# Altium schematic sheet LPC1343.SchDoc
size A4
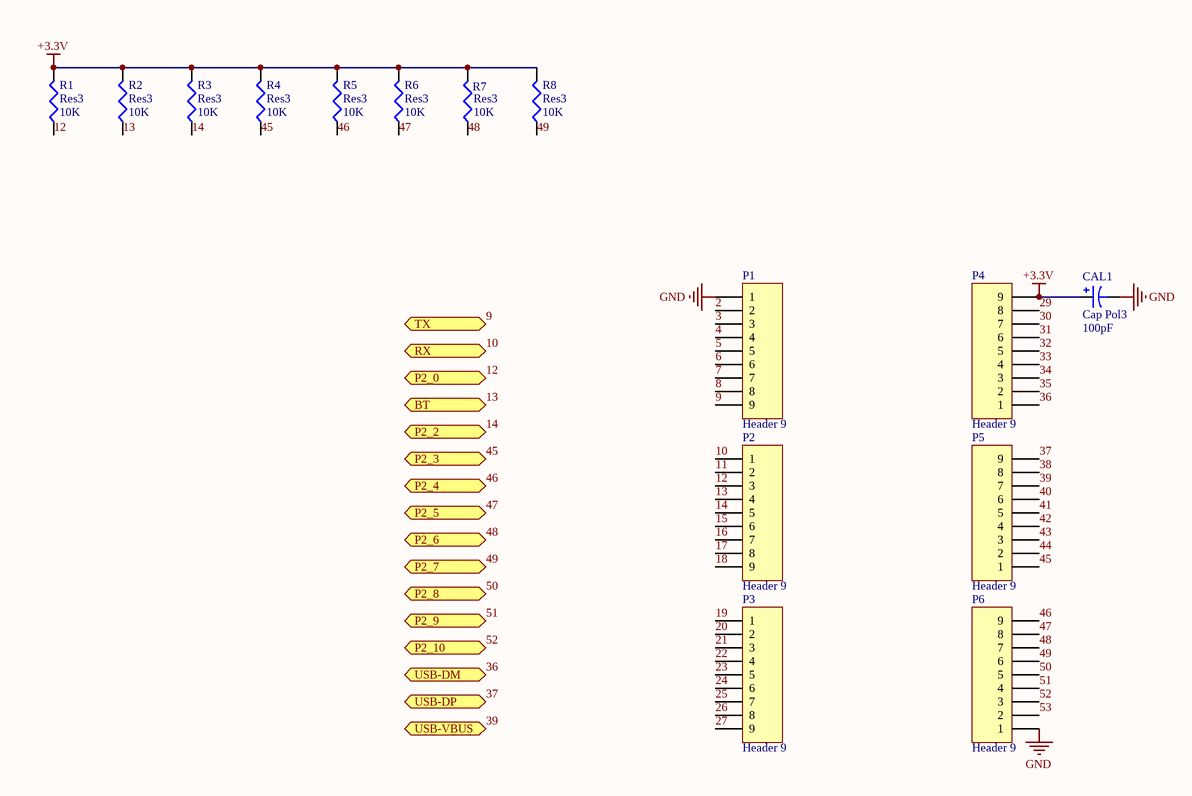
[diagram p0: LPC1343.SchDoc]

## Parts
CAL1  Cap Pol3  value 100pF  [C0805]
P1  Header 9  [HDR1X9]
P2  Header 9  [HDR1X9]
P3  Header 9  [HDR1X9]
P4  Header 9  [HDR1X9]
P5  Header 9  [HDR1X9]
P6  Header 9  [HDR1X9]
R1  Res3  value 10K  [2012[0805]]
R2  Res3  value 10K  [2012[0805]]
R3  Res3  value 10K  [2012[0805]]
R4  Res3  value 10K  [2012[0805]]
R5  Res3  value 10K  [2012[0805]]
R6  Res3  value 10K  [2012[0805]]
R7  Res3  value 10K  [2012[0805]]
R8  Res3  value 10K  [2012[0805]]

## Ports
BT (in), P2_0 (bidir), P2_2 (bidir), P2_3 (bidir), P2_4 (bidir), P2_5 (bidir), P2_6 (bidir), P2_7 (bidir), P2_8 (bidir), P2_9 (bidir), P2_10 (bidir), RX (bidir), TX (bidir), USB-DM (bidir), USB-DP (bidir), USB-VBUS

## Nets
+3.3V: CAL1.1 P4.9 R1.2 R2.2 R3.2 R4.2 R5.2 R6.2 R7.2 R8.2
GND: CAL1.2 P1.1 P6.1
2: P1.2
3: P1.3
4: P1.4
5: P1.5
6: P1.6
7: P1.7
8: P1.8
9: P1.9 ; port TX
10: P2.1 ; port RX
11: P2.2
12: P2.3 R1.1 ; port P2_0
13: P2.4 R2.1 ; port BT
14: P2.5 R3.1 ; port P2_2
15: P2.6
16: P2.7
17: P2.8
18: P2.9
19: P3.1
20: P3.2
21: P3.3
22: P3.4
23: P3.5
24: P3.6
25: P3.7
26: P3.8
27: P3.9
29: P4.8
30: P4.7
31: P4.6
32: P4.5
33: P4.4
34: P4.3
35: P4.2
36: P4.1 ; port USB-DM
37: P5.9 ; port USB-DP
38: P5.8
39: P5.7 ; port USB-VBUS
40: P5.6
41: P5.5
42: P5.4
43: P5.3
44: P5.2
45: P5.1 R4.1 ; port P2_3
46: P6.9 R5.1 ; port P2_4
47: P6.8 R6.1 ; port P2_5
48: P6.7 R7.1 ; port P2_6
49: P6.6 R8.1 ; port P2_7
50: P6.5 ; port P2_8
51: P6.4 ; port P2_9
52: P6.3 ; port P2_10
53: P6.2

## Library data of the parts
CAL1 = Cap Pol3: Polarized Capacitor (Surface Mount); Published: 8-Jun-2000; LatestRevisionDate: 17-Jul-2002; LatestRevisionNote: Re-released for DXP Platform.; PackageReference: C0805; Publisher: Altium Limited
P1-P6 = Header 9: Header, 9-Pin; LatestRevisionDate: 17-Jul-2002; LatestRevisionNote: Re-released for DXP Platform.; Publisher: Altium Limited
R1-R8 = Res3: Resistor; Published: 8-Jun-2000; LatestRevisionDate: 29-May-2009; LatestRevisionNote: IPC-7351 Footprint Added.; PackageReference: J1-0603; Publisher: Altium Limited; PackageDescription: Chip Resistor